# Altium schematic sheet ST_LINK_V2_1.SchDoc
size A4; SheetNumber: 1; SheetTotal: 1
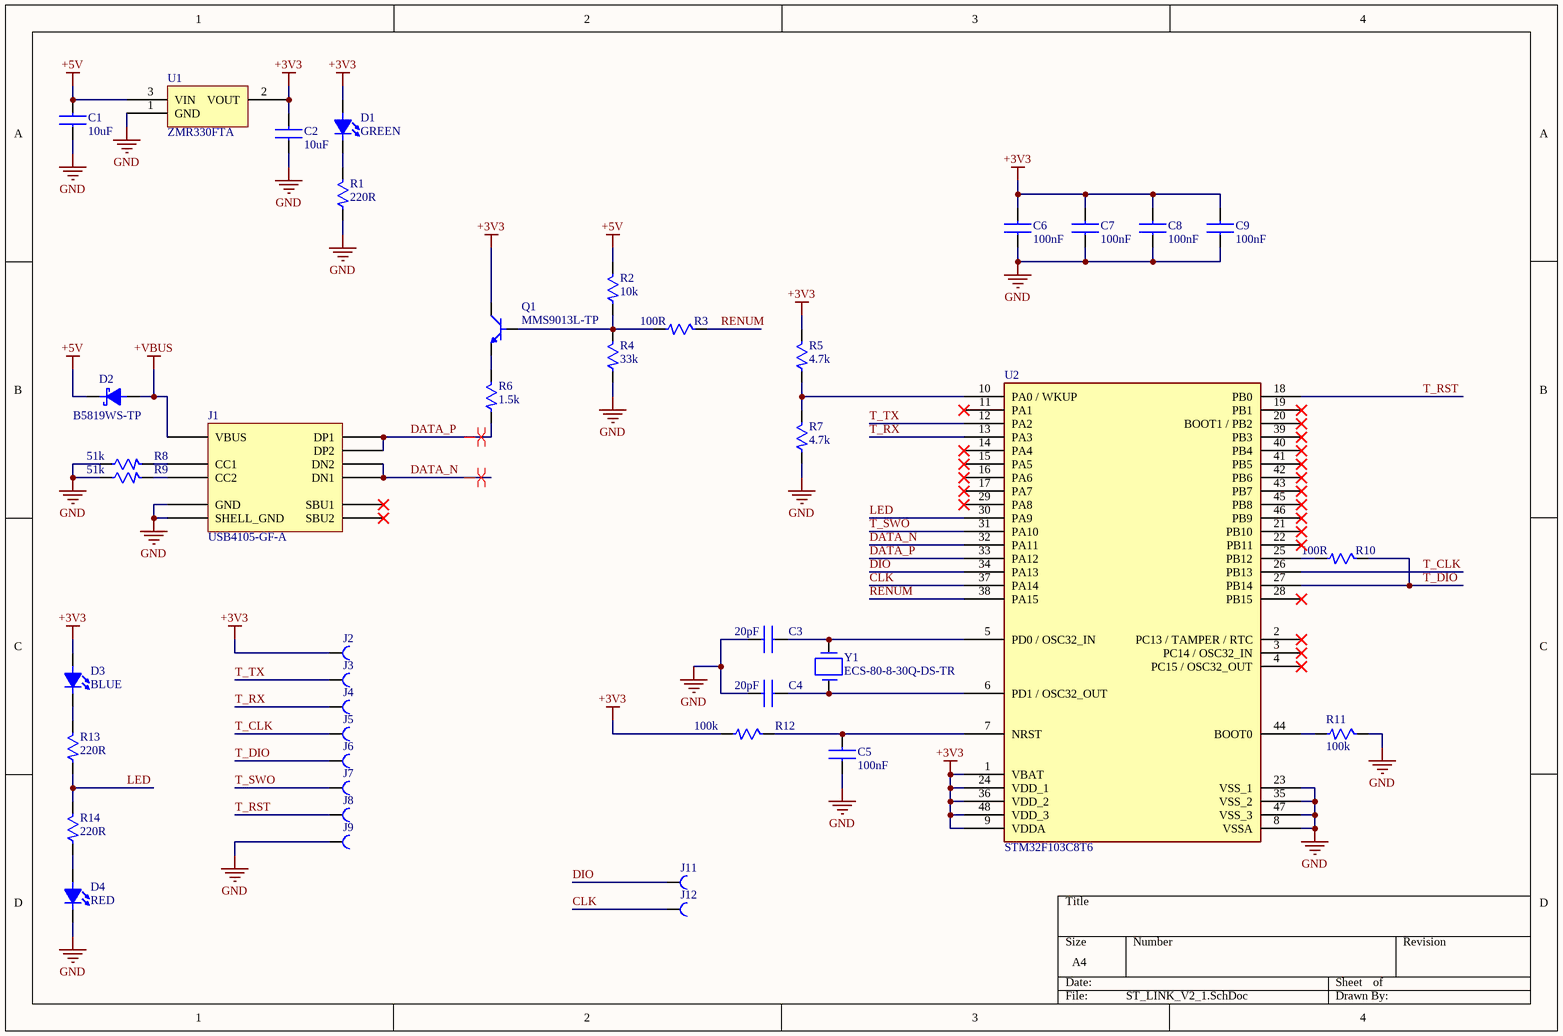
[diagram p0: ST_LINK_V2_1.SchDoc]

## Parts
C1  10uF  [C_0603]
C2  10uF  [C_0603]
C3  20pF  [C_0603]
C4  20pF  [C_0603]
C5  100nF  [C_0603]
C6  100nF  [C_0603]
C7  100nF  [C_0603]
C8  100nF  [C_0603]
C9  100nF  [C_0603]
D1  GREEN  [LED_0603_G]
D2  B5819WS-TP  [SOD_323]
D3  BLUE  [LED_0603_B]
D4  RED  [LED_0603_R]
J1  USB4105-GF-A  [USB4105-GF-A]
J2  CONST_PAD  [CONST_PAD]  (value not drawn)  (no BOM)
J3  CONST_PAD  [CONST_PAD]  (value not drawn)  (no BOM)
J4  CONST_PAD  [CONST_PAD]  (value not drawn)  (no BOM)
J5  CONST_PAD  [CONST_PAD]  (value not drawn)  (no BOM)
J6  CONST_PAD  [CONST_PAD]  (value not drawn)  (no BOM)
J7  CONST_PAD  [CONST_PAD]  (value not drawn)  (no BOM)
J8  CONST_PAD  [CONST_PAD]  (value not drawn)  (no BOM)
J9  CONST_PAD  [CONST_PAD]  (value not drawn)  (no BOM)
J11  CONST_PAD  [CONST_PAD]  (value not drawn)  (no BOM)
J12  CONST_PAD  [CONST_PAD]  (value not drawn)  (no BOM)
Q1  MMS9013L-TP  [SOT_23]
R1  220R  [R_0603]
R2  10k  [R_0603]
R3  100R  [R_0603]
R4  33k  [R_0603]
R5  4.7k  [R_0603]
R6  1.5k  [R_0603]
R7  4.7k  [R_0603]
R8  51k  [R_0603]
R9  51k  [R_0603]
R10  100R  [R_0603]
R11  100k  [R_0603]
R12  100k  [R_0603]
R13  220R  [R_0603]
R14  220R  [R_0603]
U1  ZMR330FTA  [SOT_23_REG]
U2  STM32F103C8T6  [LQFP48]
Y1  ECS-80-8-30Q-DS-TR  [ECS-80-8-30Q-DS-TR]

## Nets
+3V3: C2.2 C6.2 C7.2 C8.2 C9.2 D1.2(anode) D3.2(anode) J2.0(PAD) Q1.3 R5.2 R12.1 U1.2(VOUT) U2.1(VBAT) U2.9(VDDA) U2.24(VDD_1) U2.36(VDD_2) U2.48(VDD_3)
+5V: C1.2 D2.1(cathode) R2.2 U1.3(VIN)
+VBUS: D2.2(anode) J1.VBUS
GND: C1.1 C2.1 C3.1 C4.1 C5.1 C6.1 C7.1 C8.1 C9.1 D4.1(cathode) J1.GND J1.SHELL_GND J9.0(PAD) R1.1 R4.1 R7.1 R8.2 R9.2 R11.2 U1.1(GND) U2.8(VSSA) U2.23(VSS_1) U2.35(VSS_2) U2.47(VSS_3)
CLK: J12.0(PAD) U2.37(PA14)
DATA_N: J1.DN1 J1.DN2 U2.32(PA11)
DATA_P: J1.DP1 J1.DP2 R6.1 U2.33(PA12)
DIO: J11.0(PAD) U2.34(PA13)
LED: R13.1 R14.2 U2.30(PA9)
RENUM: R3.2 U2.38(PA15)
T_CLK: J5.0(PAD) U2.26(PB13)
T_DIO: J6.0(PAD) R10.2 U2.27(PB14)
T_RST: J8.0(PAD) U2.18(PB0)
T_RX: J4.0(PAD) U2.13(PA3)
T_SWO: J7.0(PAD) U2.31(PA10)
T_TX: J3.0(PAD) U2.12(PA2)
NetC3_2: C3.2 U2.5(PD0_/_OSC32_IN) Y1.2
NetC4_2: C4.2 U2.6(PD1_/_OSC32_OUT) Y1.1
NetC5_2: C5.2 R12.2 U2.7(NRST)
NetD1_1: D1.1(cathode) R1.2
NetD3_1: D3.1(cathode) R13.2
NetD4_2: D4.2(anode) R14.1
NetJ1_CC1: J1.CC1 R8.1
NetJ1_CC2: J1.CC2 R9.1
NetQ1_1: Q1.1 R2.1 R3.1 R4.2
NetQ1_2: Q1.2 R6.2
NetR5_1: R5.1 R7.2 U2.10(PA0_/_WKUP)
NetR10_1: R10.1 U2.25(PB12)
NetR11_1: R11.1 U2.44(BOOT0)

Not connected (* = marked no-connect by the designer): J1 SBU1* SBU2*; U2 2(PC13_/_TAMPER_/_RTC)* 3(PC14_/_OSC32_IN)* 4(PC15_/_OSC32_OUT)* 11(PA1)* 14(PA4)* 15(PA5)* 16(PA6)* 17(PA7)* 19(PB1)* 20(BOOT1_/_PB2)* 21(PB10)* 22(PB11)* 28(PB15)* 29(PA8)* 39(PB3)* 40(PB4)* 41(PB5)* 42(PB6)* 43(PB7)* 45(PB8)* 46(PB9)*

## Layout directives
differential pair: DATA_N, DATA_P

## Library data of the parts
C1 C2 = C1608X5R0J106K080AB: C Series 0603 10 uF 6.3 V ±10 % Tolerance X5R SMT Multilayer Ceramic Capacitor; Manufacturer: TDK; Voltage Rating: 6.3V; Tolerance: 10%; Supplier 1: Rs; Manufacturer Part Number: C1608X5R0J106K080AB; RoHS: Yes; Category: Ceramic Capacitors; Stock 1: 5030; Pricing 1: 50=0.01610, 100=0.14500, 250=0.12600, 500=0.10600 (GBP); Mount: Surface Mount; Case/Package: 0603; Case Code (Metric): 1608; Case Code (Imperial): 0603; Dielectric Material: Ceramic; Weight: 7.1E-05oz; Min Operating Temperature: -55°C; Max Operating Temperature: 85°C; Capacitance: 10uF; Packaging: Tape and Reel; Voltage Rating (DC): 6.3V; Dielectric: X5R; Termination: SMD/SMT; Construction: Flat; Package Quantity: 1; Resistor Type: Ceramic; Voltage: 6.3V; Series: C; Length: 1.6mm; Width: 0.031inch; Height: 0.8mm; Depth: 0.8mm; Thickness: 0.035inch; Radiation Hardening: No; Lead Free: Lead Free; Reach SVHC Compliant: Yes; RoHS Compliant: Yes; ComponentLink1URL: https://datasheet.ciiva.com/23802/1796654-23802758.pdf?src-supplier=Newark; ComponentLink1Description: https://datasheet.ciiva.com/23802/1796654-23802758.pdf?src-supplier=Newark; ComponentLink2URL: https://datasheet.ciiva.com/6288/tdkmlcccaprange-6288538.pdf?src-supplier=Digi-Key; ComponentLink2Description: https://datasheet.ciiva.com/6288/tdkmlcccaprange-6288538.pdf?src-supplier=Digi-Key; ComponentLink3URL: https://datasheet.ciiva.com/28451/1796654-28451132.pdf?src-supplier=Element14; ComponentLink3Description: https://datasheet.ciiva.com/28451/1796654-28451132.pdf?src-supplier=Element14; ComponentLink4URL: https://datasheet.ciiva.com/6288/tdkmlcccaprange-6288541.pdf?src-supplier=Digi-Key; ComponentLink4Description: https://datasheet.ciiva.com/6288/tdkmlcccaprange-6288541.pdf?src-supplier=Digi-Key; ComponentLink5URL: https://datasheet.ciiva.com/16448/general-b11-16448959.pdf?src-supplier=Future+Electronics; ComponentLink5Description: https://datasheet.ciiva.com/16448/general-b11-16448959.pdf?src-supplier=Future+Electronics; ComponentLink6URL: https://datasheet.ciiva.com/22719/1796654-22719535.pdf?src-supplier=Element14; ComponentLink6Description: https://datasheet.ciiva.com/22719/1796654-22719535.pdf?src-supplier=Element14; Supplier Part Number 1: 7882887P
C3 C4 = C0603C200K4HACAUTO: Cap Cer 0603 20PF 16V Ultra Stab; Manufacturer: KEMET; Supplier 1: Mouser; Manufacturer Part Number: C0603C200K4HACAUTO; RoHS: Yes; Category: Ceramic Capacitors; Stock 1: 12700; Pricing 1: 1=0.18000, 10=0.08500, 50=0.08500, 100=0.04000, 1000=0.02400, 10000=0.02000 (USD); RoHS Compliant: Yes; Supplier Part Number 1: 80-C0603C200K4HAUTO
C5-C9 = C0603C104M4RAC7411: Cap Ceramic 0.1uF 16V X7R 20% SMD 0603 125 Paper T/R; Manufacturer: KEMET; Dissipation Factor: 3.5%; Supplier 1: Mouser; Manufacturer Part Number: C0603C104M4RAC7411; RoHS: Yes; Category: Ceramic Capacitors; Stock 1: 1220822; Pricing 1: 1=0.10000, 10=0.02700, 50=0.02700, 100=0.01200, 1000=0.00700, 10000=0.00500 (USD); Mount: Surface Mount; Case/Package: 0603; Case Code (Imperial): 0603; Case Code (Metric): 1608; Dielectric Material: Ceramic; Min Operating Temperature: -55°C; Max Operating Temperature: 125°C; Capacitance: 100nF; Package Quantity: 10000; Voltage Rating: 16V; Tolerance: 20%; Packaging: Tape and Reel; Voltage Rating (DC): 16V; Dielectric: X7R; Termination: SMD/SMT; Series: C; Construction: Flat; Length: 1.6mm; Width: 0.8mm; Height: 0.8mm; Lead Pitch: 0.7mm; Thickness: 0.034inch; Depth: 0.8mm; Radiation Hardening: No; RoHS Compliant: Yes; ComponentLink1URL: http://components.arrow.com/part/dataview/3446650S8993799N7429?src-supplier=Arrow+Electronics; ComponentLink1Description: http://components.arrow.com/part/dataview/3446650S8993799N7429?src-supplier=Arrow+Electronics; ComponentLink2URL: http://www.mouser.com/ds/2/212/KEM_C1002_X7R_SMD-1102033.pdf?src-supplier=Mouser; ComponentLink2Description: http://www.mouser.com/ds/2/212/KEM_C1002_X7R_SMD-1102033.pdf?src-supplier=Mouser; ComponentLink3URL: http://www.farnell.com/datasheets/2747785.pdf?src-supplier=Farnell; ComponentLink3Description: http://www.farnell.com/datasheets/2747785.pdf?src-supplier=Farnell; ComponentLink4URL: http://www.jameco.com/Jameco/Products/ProdDS/1565046.pdf?src-supplier=Jameco; ComponentLink4Description: http://www.jameco.com/Jameco/Products/ProdDS/1565046.pdf?src-supplier=Jameco; ComponentLink5URL: http://www.farnell.com/datasheets/2747785.pdf?src-supplier=Element14; ComponentLink5Description: http://www.farnell.com/datasheets/2747785.pdf?src-supplier=Element14; ComponentLink6URL: http://www.farnell.com/datasheets/2747785.pdf?src-supplier=Newark; ComponentLink6Description: http://www.farnell.com/datasheets/2747785.pdf?src-supplier=Newark; ComponentLink7URL: https://api.kemet.com/component-edge/download/datasheet/C0603C104M4RAC7411.pdf?src-supplier=Digi-Key; ComponentLink7Description: https://api.kemet.com/component-edge/download/datasheet/C0603C104M4RAC7411.pdf?src-supplier=Digi-Key; ComponentLink8URL: http://www.kemet.com/docfinder?Partnumber=C0603C104M4RAC7411&src-supplier=Digi-Key; ComponentLink8Description: http://www.kemet.com/docfinder?Partnumber=C0603C104M4RAC7411&src-supplier=Digi-Key; ComponentLink9URL: http://capacitoredge.kemet.com/capedge2/DataSheet?pn=C0603C104M4RAC7411&src-supplier=Avnet; ComponentLink9Description: http://capacitoredge.kemet.com/capedge2/DataSheet?pn=C0603C104M4RAC7411&src-supplier=Avnet; ComponentLink10URL: https://www.verical.com/server-webapp/html/getDatasheet?partID=58458&src-supplier=Verical; ComponentLink10Description: https://www.verical.com/server-webapp/html/getDatasheet?partID=58458&src-supplier=Verical; Supplier Part Number 1: 80-C0603C104M4R7411
D1 = 150060GS75000: Led, Green, 520 Nm, 3.2 V, 30 Ma, 430 Mcd Rohs Compliant: Yes; Manufacturer: Wurth Electronics; Lens Color: Colorless; Wavelength: 520nm; Viewing Angle: 140°; Lens Style: Clear,Flat,Rectangular; Luminous Intensity: 430mcd; Forward Current: 30mA; Forward Voltage: 3.2V; Test Current: 20mA; Lens Transparency: Clear; Lens Size: 0.7mm; Supplier 1: Rs; Manufacturer Part Number: 150060GS75000; RoHS: Yes; Category: LEDs; Stock 1: 20200; Pricing 1: 500=0.00083, 1000=0.07900, 2000=0.07500, 4000=0.07100 (GBP); Mount: Surface Mount; Case/Package: 0603; Color: Green; Case Code (Metric): 1608; Case Code (Imperial): 0603; Min Operating Temperature: -40°C; Max Operating Temperature: 85°C; Package Quantity: 1; Packaging: Cut Tape; Dominant Wavelength: 520nm; Series: WL-SMCW; Length: 1.6mm; Width: 0.8mm; Height: 0.8mm; Lead Free: Lead Free; RoHS Compliant: Yes; ComponentLink1URL: https://datasheet.ciiva.com/29562/150060gs75000-29562868.pdf?src-supplier=Digi-Key; ComponentLink1Description: https://datasheet.ciiva.com/29562/150060gs75000-29562868.pdf?src-supplier=Digi-Key; ComponentLink2URL: https://datasheet.ciiva.com/29279/759427-da-01-en-chipled-0603-w-kl-gruen-150060gs75000-29279201.pdf?src-supplier=Conrad; ComponentLink2Description: https://datasheet.ciiva.com/29279/759427-da-01-en-chipled-0603-w-kl-gruen-150060gs75000-29279201.pdf?src-supplier=Conrad; ComponentLink3URL: https://datasheet.ciiva.com/29562/150060gs75000-29562869.pdf?src-supplier=Digi-Key; ComponentLink3Description: https://datasheet.ciiva.com/29562/150060gs75000-29562869.pdf?src-supplier=Digi-Key; ComponentLink4URL: https://datasheet.ciiva.com/29562/150060gs75000-29562870.pdf?src-supplier=Digi-Key; ComponentLink4Description: https://datasheet.ciiva.com/29562/150060gs75000-29562870.pdf?src-supplier=Digi-Key; Supplier Part Number 1: 8154209P
D2 = B5819WS-TP: DIODE SCHOTTKY 40V 1A SOD323; Manufacturer: MCC; Max Surge Current: 10A; Forward Voltage: 900mV; Max Reverse Leakage Current: 1mA; Element Configuration: Single; Supplier 1: Future Electronics; Manufacturer Part Number: B5819WS-TP; RoHS: Yes; Category: Rectifier Diodes; Stock 1: 168000; Pricing 1: 3000=0.05800, 9000=0.05580, 15000=0.05480, 45000=0.05280, 75000=0.05100 (USD); Mount: Surface Mount; Number of Pins: 2; Min Operating Temperature: -65°C; Max Operating Temperature: 125°C; Package Quantity: 1; Packaging: Tape and Reel; Average Rectified Current: 1A; Peak Non-Repetitive Surge Current: 10A; Max Reverse Voltage (DC): 40V; Series: -; Radiation Hardening: No; Lead Free: Lead Free; RoHS Compliant: Yes; ComponentLink1URL: https://datasheet.ciiva.com/4715/b5817ws-b5819wssod-323-48861-4715941.pdf?src-supplier=Mouser; ComponentLink1Description: https://datasheet.ciiva.com/4715/b5817ws-b5819wssod-323-48861-4715941.pdf?src-supplier=Mouser; ComponentLink2URL: https://datasheet.ciiva.com/15200/getdatasheetpartid-184930-15200423.pdf?src-supplier=Verical; ComponentLink2Description: https://datasheet.ciiva.com/15200/getdatasheetpartid-184930-15200423.pdf?src-supplier=Verical; ComponentLink3URL: https://datasheet.ciiva.com/912/b5817ws-b5819wssod-323-912736.pdf?src-supplier=Digi-Key; ComponentLink3Description: https://datasheet.ciiva.com/912/b5817ws-b5819wssod-323-912736.pdf?src-supplier=Digi-Key; ComponentLink4URL: https://datasheet.ciiva.com/912/b5817ws-b5819wssod-323-912737.pdf?src-supplier=Digi-Key; ComponentLink4Description: https://datasheet.ciiva.com/912/b5817ws-b5819wssod-323-912737.pdf?src-supplier=Digi-Key; ComponentLink5URL: https://datasheet.ciiva.com/912/b5817ws-b5819wssod-323-912735.pdf?src-supplier=Digi-Key; ComponentLink5Description: https://datasheet.ciiva.com/912/b5817ws-b5819wssod-323-912735.pdf?src-supplier=Digi-Key; Supplier Part Number 1: 6054560
D3 = 150060BS75003: SMT Mono-color Chip Led Watercle; Manufacturer: Wurth Electronics; Supplier 1: Rs; Manufacturer Part Number: 150060BS75003; RoHS: No; Category: LEDs; Stock 1: 11175; Pricing 1: 50=0.00824, 100=0.18100, 500=0.16500, 2000=0.13200 (GBP); Supplier Part Number 1: 2407008P
D4 = 150060RS75000: LED Low-Power Uni-Color Red 630nm 2V 2-Pin Chip 0603(1608Metric) T/R; Manufacturer: Wurth Electronics; Lens Color: Colorless; Viewing Angle: 140°; Lens Style: Clear,Flat,Rectangular; Luminous Intensity: 250mcd; Forward Current: 30mA; Wavelength: 625nm; Test Current: 20mA; Lens Transparency: Clear; Lens Size: 0.7mm; Supplier 1: Rs; Manufacturer Part Number: 150060RS75000; RoHS: Yes; Category: LEDs; Stock 1: 8900; Pricing 1: 500=0.00083, 1000=0.07900, 2000=0.07500, 4000=0.07200 (GBP); Mount: Surface Mount; Case/Package: 0603; Color: Red; Case Code (Metric): 1608; Case Code (Imperial): 0603; Min Operating Temperature: -40°C; Max Operating Temperature: 85°C; Package Quantity: 1; Packaging: Cut Tape; Forward Voltage: 2V; Dominant Wavelength: 625nm; Series: WL-SMCW; Length: 1.6mm; Width: 0.8mm; Height: 0.8mm; RoHS Compliant: Yes; ComponentLink1URL: https://datasheet.ciiva.com/29563/150060rs75000-29563040.pdf?src-supplier=Digi-Key; ComponentLink1Description: https://datasheet.ciiva.com/29563/150060rs75000-29563040.pdf?src-supplier=Digi-Key; ComponentLink2URL: https://datasheet.ciiva.com/29279/759428-da-01-en-chipled-0603-w-kl-rot-150060rs75000-29279196.pdf?src-supplier=Conrad; ComponentLink2Description: https://datasheet.ciiva.com/29279/759428-da-01-en-chipled-0603-w-kl-rot-150060rs75000-29279196.pdf?src-supplier=Conrad; Supplier Part Number 1: 8154203P
J1 = USB4105-GF-A: Conn USB 2.0 Type C RCP 24 POS 0.3mm/0.5mm Solder RA SMD 24 Terminal 1 Port T/R; Manufacturer: Global Connector Technology; Gender: Receptacle; Mating Cycles: 10000; Shielding: Shielded; Number of Ports: 1; Supplier 1: Future Electronics; Manufacturer Part Number: USB4105-GF-A; RoHS: No; Category: USB Connectors; Stock 1: 800; Pricing 1: 800=0.45000, 1600=0.44000, 2400=0.43500, 3200=0.43000, 4000=0.42000 (USD); Mount: Surface Mount,Through Hole,Horizontal; Contact Plating: Gold; Insulation Color: Black; Min Operating Temperature: -40°C; Max Operating Temperature: 85°C; Connector Type: USB; Series: USB4105; Termination: Solder; Flammability Rating: UL94 V-0; ComponentLink1URL: https://gct.co/files/drawings/usb4105.pdf?src-supplier=Digi-Key; ComponentLink1Description: https://gct.co/files/drawings/usb4105.pdf?src-supplier=Digi-Key; Supplier Part Number 1: 3158113
Q1 = MMS9013L-TP: Trans Gp Bjt NPN 25V 0.5A 3-PIN SOT-23 T/r; Manufacturer: MCC; Number of Elements: 1; Collector Base Voltage (VCBO): 40V; Emitter Base Voltage (VEBO): 5V; Power Dissipation: 300mW; Frequency: 150MHz; Supplier 1: Mouser; Manufacturer Part Number: MMS9013L-TP; RoHS: Yes; Category: BJTs; Stock 1: 2960; Pricing 1: 1=0.28000, 10=0.22800, 50=0.22800, 100=0.12100, 1000=0.05500, 10000=0.03600 (USD); Mount: Surface Mount; Case/Package: SOT-23; Number of Pins: 3; Min Operating Temperature: -55°C; Max Operating Temperature: 150°C; Polarity: NPN; Packaging: Tape and Reel; Collector Emitter Voltage (VCEO): 25V; ComponentLink1URL: http://components.arrow.com/part/dataview/51062823S110403N2022?src-supplier=Arrow+Electronics; ComponentLink1Description: http://components.arrow.com/part/dataview/51062823S110403N2022?src-supplier=Arrow+Electronics; Supplier Part Number 1: 833-MMS9013L-TP
R1 R13 R14 = RC0603FR-07220RL: Res Thick Film 0603 220 Ohm 1% 0.1W(1/10W) ±100ppm/°C Pad SMD T/R; Manufacturer: Yageo; Voltage Rating (DC): 50V; Power Rating: 100mW; Supplier 1: Future Electronics; Manufacturer Part Number: RC0603FR-07220RL; RoHS: Yes; Category: Chip SMD Resistors; Stock 1: 2420000; Pricing 1: 5000=0.00140, 50000=0.00130, 200000=0.00130, 625000=0.00120, 2000000=0.00110 (USD); Case/Package: 0603; Number of Pins: 2; Case Code (Imperial): 0603; Case Code (Metric): 1608; Size Code: 0603; Min Operating Temperature: -55°C; Max Operating Temperature: 155°C; Resistance: 220R; Tolerance: 1%; Packaging: Tape and Reel; Temperature Coefficient: 100ppm/°C; Resistor Type: Thick Film; Voltage Rating: 50V; Package Quantity: 1; Termination: SMD/SMT; Number of Terminations: 2; Max Power Dissipation: 100mW; Features: Moisture Resistant; Series: RC; Resistance Tolerance: 1%; Construction: Rectangular; Length: 0.063inch; Width: 0.031inch; Height: 0.022inch; Depth: 0.8mm; Reach SVHC Compliant: Yes; Lead Free: Lead Free; Military Standard: Not; RoHS Compliant: Yes; ComponentLink1URL: https://datasheet.ciiva.com/2453/pyu-r-int-thick-7-2453974.pdf?src-supplier=Digi-Key; ComponentLink1Description: https://datasheet.ciiva.com/2453/pyu-r-int-thick-7-2453974.pdf?src-supplier=Digi-Key; ComponentLink2URL: https://datasheet.ciiva.com/2453/pyu-r-int-thick-7-2453975.pdf?src-supplier=Digi-Key; ComponentLink2Description: https://datasheet.ciiva.com/2453/pyu-r-int-thick-7-2453975.pdf?src-supplier=Digi-Key; ComponentLink3URL: https://datasheet.ciiva.com/2453/pyu-r-int-thick-7-2453973.pdf?src-supplier=Digi-Key; ComponentLink3Description: https://datasheet.ciiva.com/2453/pyu-r-int-thick-7-2453973.pdf?src-supplier=Digi-Key; ComponentLink4URL: https://datasheet.ciiva.com/7746/1738695-7746301.pdf?src-supplier=Element14; ComponentLink4Description: https://datasheet.ciiva.com/7746/1738695-7746301.pdf?src-supplier=Element14; ComponentLink5URL: https://datasheet.ciiva.com/7746/1738695-7746300.pdf?src-supplier=Element14; ComponentLink5Description: https://datasheet.ciiva.com/7746/1738695-7746300.pdf?src-supplier=Element14; Supplier Part Number 1: 9705021
R2 = RC0603FR-0710KL: RES SMD 10K OHM 1% 1/10W 0603; Manufacturer: Yageo; Voltage Rating (DC): 50V; Resistance: 10kR; Temperature Coefficient: 100ppm/°C; Power Rating: 100mW; Voltage Rating: 75V; Supplier 1: Future Electronics; Manufacturer Part Number: RC0603FR-0710KL; RoHS: Yes; Category: Chip SMD Resistors; Stock 1: 252929; Pricing 1: 1=0.10000, 20=0.06640, 100=0.04840, 500=0.03040, 2500=0.01240 (USD); Case/Package: 0603; Number of Pins: 2; Case Code (Imperial): 0603; Case Code (Metric): 1608; Weight: 7.1E-05oz; Size Code: 0603; Min Operating Temperature: -55°C; Max Operating Temperature: 155°C; Packaging: Tape and Reel; Tolerance: 1%; Resistor Type: Thick Film; Termination: SMD/SMT; Features: Moisture Resistant; Series: RC; Max Power Dissipation: 100mW; Number of Terminations: 2; Resistance Tolerance: 1%; Construction: Rectangular; Length: 1.6mm; Width: 0.8mm; Height: 0.45mm; Depth: 0.8mm; Lead Pitch: 0.3mm; Reach SVHC Compliant: Yes; Lead Free: Lead Free; Military Standard: Not; RoHS Compliant: Yes; ComponentLink1URL: https://datasheet.ciiva.com/7660/38590-7660789.pdf?src-supplier=Element14; ComponentLink1Description: https://datasheet.ciiva.com/7660/38590-7660789.pdf?src-supplier=Element14; ComponentLink2URL: https://datasheet.ciiva.com/7983/443971-7983596.pdf?src-supplier=Element14; ComponentLink2Description: https://datasheet.ciiva.com/7983/443971-7983596.pdf?src-supplier=Element14; ComponentLink3URL: https://datasheet.ciiva.com/22747/443971-22747519.pdf?src-supplier=Element14; ComponentLink3Description: https://datasheet.ciiva.com/22747/443971-22747519.pdf?src-supplier=Element14; ComponentLink4URL: https://datasheet.ciiva.com/46440/1868787-46440891.pdf?src-supplier=Element14; ComponentLink4Description: https://datasheet.ciiva.com/46440/1868787-46440891.pdf?src-supplier=Element14; ComponentLink5URL: https://datasheet.ciiva.com/7746/1738695-7746239.pdf?src-supplier=Element14; ComponentLink5Description: https://datasheet.ciiva.com/7746/1738695-7746239.pdf?src-supplier=Element14; Supplier Part Number 1: 3349388
R3 R10 = AR0603FR-07100RL: Res Thick Film 0603 100 Ohm 1% 1/10W ±100ppm/°C Molded SMD SMD Paper T/R; Manufacturer: Yageo; Max Power Dissipation: 100mW; Supplier 1: Mouser; Manufacturer Part Number: AR0603FR-07100RL; RoHS: Yes; Category: Chip SMD Resistors; Stock 1: 2721; Pricing 1: 1=0.44000, 10=0.33800, 50=0.33800, 100=0.14200, 1000=0.07900, 10000=0.06400 (USD); Case/Package: 0603; Contact Plating: Gold; Min Operating Temperature: -55°C; Max Operating Temperature: 155°C; Resistance: 100R; Tolerance: 1%; Packaging: Tape and Reel; Resistor Type: Thick Film; Number of Terminations: 2; Temperature Coefficient: 100ppm/°C; Features: Moisture Resistant; Series: AR; Length: 0.063inch; Width: 0.032inch; Height: 0.022inch; Radiation Hardening: No; RoHS Compliant: Yes; ComponentLink1URL: https://datasheet.ciiva.com/8887/pyu-ar-51-rohs-l-7-8887862.pdf?src-supplier=Avnet; ComponentLink1Description: https://datasheet.ciiva.com/8887/pyu-ar-51-rohs-l-7-8887862.pdf?src-supplier=Avnet; Supplier Part Number 1: 603-AR0603FR-07100RL
R4 = RC0603FR-0733KL: Res Thick Film 0603 33K Ohm 1% 0.1W(1/10W) ±100ppm/C Pad SMD T/R; Manufacturer: Yageo; Resistance: 33kR; Voltage Rating (DC): 50V; Temperature Coefficient: 100ppm/°C; Power Rating: 100mW; Supplier 1: Future Electronics; Manufacturer Part Number: RC0603FR-0733KL; RoHS: Yes; Category: Chip SMD Resistors; Stock 1: 3300000; Pricing 1: 5000=0.00140, 50000=0.00130, 200000=0.00130, 625000=0.00120, 2000000=0.00110 (USD); Case/Package: 0603; Number of Pins: 2; Case Code (Imperial): 0603; Case Code (Metric): 1608; Size Code: 0603; Min Operating Temperature: -55°C; Max Operating Temperature: 155°C; Tolerance: 1%; Packaging: Tape and Reel; Resistor Type: Thick Film; Voltage Rating: 50V; Package Quantity: 1; Termination: SMD/SMT; Number of Terminations: 2; Max Power Dissipation: 100mW; Features: Moisture Resistant; Series: RC; Resistance Tolerance: 1%; Construction: Rectangular; Length: 0.063inch; Width: 0.031inch; Height: 0.022inch; Depth: 0.8mm; Reach SVHC Compliant: Yes; Lead Free: Lead Free; Military Standard: Not; RoHS Compliant: Yes; ComponentLink1URL: https://datasheet.ciiva.com/46395/443971-46395005.pdf?src-supplier=Element14; ComponentLink1Description: https://datasheet.ciiva.com/46395/443971-46395005.pdf?src-supplier=Element14; ComponentLink2URL: https://datasheet.ciiva.com/2454/pyu-r-int-thick-7-2454010.pdf?src-supplier=Digi-Key; ComponentLink2Description: https://datasheet.ciiva.com/2454/pyu-r-int-thick-7-2454010.pdf?src-supplier=Digi-Key; ComponentLink3URL: https://datasheet.ciiva.com/2454/pyu-r-int-thick-7-2454011.pdf?src-supplier=Digi-Key; ComponentLink3Description: https://datasheet.ciiva.com/2454/pyu-r-int-thick-7-2454011.pdf?src-supplier=Digi-Key; ComponentLink4URL: https://datasheet.ciiva.com/2454/pyu-r-int-thick-7-2454009.pdf?src-supplier=Digi-Key; ComponentLink4Description: https://datasheet.ciiva.com/2454/pyu-r-int-thick-7-2454009.pdf?src-supplier=Digi-Key; ComponentLink5URL: https://datasheet.ciiva.com/7746/443971-7746332.pdf?src-supplier=Element14; ComponentLink5Description: https://datasheet.ciiva.com/7746/443971-7746332.pdf?src-supplier=Element14; ComponentLink6URL: https://datasheet.ciiva.com/7746/443971-7746333.pdf?src-supplier=Element14; ComponentLink6Description: https://datasheet.ciiva.com/7746/443971-7746333.pdf?src-supplier=Element14; ComponentLink7URL: https://datasheet.ciiva.com/15189/getdatasheetpartid-353493-15189706.pdf?src-supplier=Verical; ComponentLink7Description: https://datasheet.ciiva.com/15189/getdatasheetpartid-353493-15189706.pdf?src-supplier=Verical; Supplier Part Number 1: 9831728
R5 R7 = 1622960-1: Res Thick Film 0603 4.7K Ohm 1% 0.1W(1/10W) ±100ppm/C Pad SMD T/R; Manufacturer: TE Connectivity; Supplier 1: Newark; Manufacturer Part Number: 1622960-1; RoHS: Yes; Category: Uncategorized; Stock 1: 19907; Pricing 1: 1=0.004000, 25=0.004000, 100=0.004000, 250=0.004000, 500=0.004000, 1000=0.004000 (USD); ComponentLink1URL: https://datasheet.ciiva.com/6538/eng-cd-1622282-ba-6538072.pdf?src-supplier=Digi-Key; ComponentLink1Description: https://datasheet.ciiva.com/6538/eng-cd-1622282-ba-6538072.pdf?src-supplier=Digi-Key; ComponentLink2URL: https://datasheet.ciiva.com/8912/eng-ds-1773204-f-8912646.pdf?src-supplier=Avnet; ComponentLink2Description: https://datasheet.ciiva.com/8912/eng-ds-1773204-f-8912646.pdf?src-supplier=Avnet; Supplier Part Number 1: 46AK9345
R6 = RC0603FR-071K5L: Res General Purpose Thick Film 0603 1.5K Ohm 1% 1/10W ±100ppm/°C Molded SMD Paper T/R; Manufacturer: Yageo; Voltage Rating (DC): 50V; Resistance: 1.5kR; Power Rating: 100mW; Supplier 1: Future Electronics; Manufacturer Part Number: RC0603FR-071K5L; RoHS: Yes; Category: Chip SMD Resistors; Stock 1: 16310000; Pricing 1: 5000=0.00150, 50000=0.00140, 100000=0.00140, 200000=0.00140, 375000=0.00140, 625000=0.00130, 1250000=0.00130, 2000000=0.00120, 5000000=0.00120 (USD); Case/Package: 0603; Number of Pins: 2; Case Code (Metric): 1608; Case Code (Imperial): 0603; Size Code: 0603; Min Operating Temperature: -55°C; Max Operating Temperature: 155°C; Tolerance: 1%; Packaging: Tape and Reel; Temperature Coefficient: 100ppm/°C; Resistor Type: Thick Film; Voltage Rating: 50V; Package Quantity: 1; Number of Terminations: 2; Termination: SMD/SMT; Max Power Dissipation: 100mW; Features: Moisture Resistant; Series: RC; Resistance Tolerance: 1%; Construction: Rectangular; Length: 0.063inch; Width: 0.031inch; Height: 0.022inch; Depth: 0.8mm; Reach SVHC Compliant: Yes; Lead Free: Lead Free; Military Standard: Not; RoHS Compliant: Yes; Supplier Part Number 1: 5194295
R8 R9 = AF0603FR-0751KL: Res Thick Film 0603 51K Ohm 1% 1/10W ±100ppm/°C Molded SMD Paper T/R; Manufacturer: Yageo; Resistance: 51kR; Max Power Dissipation: 100mW; Supplier 1: Mouser; Manufacturer Part Number: AF0603FR-0751KL; RoHS: Yes; Category: Chip SMD Resistors; Stock 1: 893; Pricing 1: 1=0.19000, 10=0.06300, 50=0.06300, 100=0.02600, 1000=0.01200, 10000=0.00800 (USD); Case/Package: 0603; Min Operating Temperature: -55°C; Max Operating Temperature: 155°C; Packaging: Tape and Reel; Resistor Type: Thick Film; Number of Terminations: 2; Tolerance: 1%; Temperature Coefficient: 100ppm/°C; Features: Moisture Resistant,Anti-Sulfur; Length: 0.063inch; Width: 0.031inch; Height: 0.022inch; RoHS Compliant: Yes; ComponentLink1URL: http://www.yageo.com/documents/recent/PYu-AF_51_RoHS_L_5.pdf?src-supplier=Digi-Key; ComponentLink1Description: http://www.yageo.com/documents/recent/PYu-AF_51_RoHS_L_5.pdf?src-supplier=Digi-Key; Supplier Part Number 1: 603-AF0603FR-0751KL
R11 R12 = RC0603FR-07100KL: RES SMD 100K OHM 1% 1/10W 0603; Manufacturer: Yageo; Resistance: 100kR; Voltage Rating (DC): 50V; Temperature Coefficient: 100ppm/°C; Power Rating: 100mW; Working Voltage: 75V; Supplier 1: Future Electronics; Manufacturer Part Number: RC0603FR-07100KL; RoHS: Yes; Category: Chip SMD Resistors; Stock 1: 32435000; Pricing 1: 5000=0.00140, 50000=0.00130, 200000=0.00130, 625000=0.00120, 2000000=0.00110 (USD); Case/Package: 0603; Number of Pins: 2; Case Code (Imperial): 0603; Case Code (Metric): 1608; Min Operating Temperature: -55°C; Max Operating Temperature: 155°C; Tolerance: 1%; Packaging: Tape and Reel; Resistor Type: Thick Film; Voltage Rating: 50V; Termination: SMD/SMT; Number of Terminations: 2; Features: Moisture Resistant; Series: RC; Max Power Dissipation: 100mW; Resistance Tolerance: 1%; Construction: Rectangular; Technology: THICK FILM; Length: 1.6mm; Width: 0.8mm; Height: 0.45mm; Depth: 0.8mm; Reach SVHC Compliant: Yes; Lead Free: Lead Free; Military Standard: Not; RoHS Compliant: Yes; Supplier Part Number 1: 3697448
U1 = ZMR330FTA: ZMR330 Series 3.3 V 50 mA Fixed Output SMT Miniature Voltage Regulator - SOT-23; Manufacturer: Diodes Zetex; Power Rating: 500mW; Max Input Voltage: 24V; Min Input Voltage: 4.8V; Number of Outputs: 1; Max Output Current: 50mA; Output Voltage: 3.3V; Polarity: Positive; Power Supply Rejection Ratio (PSRR): 55dB; Supplier 1: Rs; Manufacturer Part Number: ZMR330FTA; RoHS: Yes; Category: Voltage Regulators - Linear; Stock 1: 4550; Pricing 1: 30=0.15480, 150=0.66200, 750=0.55400, 1500=0.43800 (GBP); Mount: Surface Mount; Case/Package: SOT-23; Number of Pins: 3; Weight: 0.000282oz; Min Operating Temperature: -55°C; Max Operating Temperature: 125°C; Max Power Dissipation: 500mW; Package Quantity: 3000; Packaging: Tape and Reel; Output Current: 50mA; Number of Regulators: 1; Power Dissipation: 500mW; Min Output Voltage: 3.3V; Output Type: Fixed; Series: -; Length: 3.04mm; Width: 1.4mm; Height: 1.02mm; Radiation Hardening: No; Reach SVHC Compliant: Yes; Lead Free: Lead Free; RoHS Compliant: Yes; ComponentLink1URL: https://datasheet.ciiva.com/2040/zmrseries-2040368.pdf?src-supplier=Digi-Key; ComponentLink1Description: https://datasheet.ciiva.com/2040/zmrseries-2040368.pdf?src-supplier=Digi-Key; ComponentLink2URL: https://datasheet.ciiva.com/8240/zmrseries-8240837.pdf?src-supplier=Avnet; ComponentLink2Description: https://datasheet.ciiva.com/8240/zmrseries-8240837.pdf?src-supplier=Avnet; ComponentLink3URL: https://datasheet.ciiva.com/16509/zmrseries-16509194.pdf?src-supplier=Future+Electronics; ComponentLink3Description: https://datasheet.ciiva.com/16509/zmrseries-16509194.pdf?src-supplier=Future+Electronics; Supplier Part Number 1: 7106313P
U2 = STM32F103C8T6: IC MCU 32BIT 64KB FLASH 48LQFP; Manufacturer: STMicroelectronics; RAM Size: 20KB; Frequency: 72MHz; Max Power Dissipation: 363mW; Interface: I2C,SPI,USB,CAN,USART; Number of I/Os: 37; Number of Timers/Counters: 3; Max Supply Voltage: 3.6V; Number of ADC Channels: 10; Min Supply Voltage: 2V; Oscillator Type: Internal; Number of Programmable I/O: 48; Data Bus Width: 32b; Number of Bits: 32; Watchdog Timer: Yes; Peripherals: POR,PWM,WDT,DMA,Temp Sensor,I2C; Core Architecture: ARM; Number of PWM Channels: 1; Number of SPI Channels: 2; Supplier 1: Mouser; Manufacturer Part Number: STM32F103C8T6; RoHS: Yes; Category: Microcontrollers; Stock 1: 33571; Pricing 1: 1=6.66000, 10=6.02000, 50=4.98000, 100=4.98000, 1000=3.75000, 10000=3.67000 (USD); Case/Package: LQFP; Number of Pins: 48; Weight: 0.006349oz; Min Operating Temperature: -40°C; Max Operating Temperature: 85°C; Packaging: Tray; Package Quantity: 1500; Density: 64KB; Memory Type: FLASH; Max Frequency: 72MHz; Memory Size: 64KB; Series: STM32F103C8; Termination: SMD/SMT; Number of I2C Channels: 2; Address Bus Width: 32b; Length: 7mm; Width: 7mm; Height: 1.4mm; Radiation Hardening: No; Lead Free: Lead Free; Reach SVHC Compliant: Yes; RoHS Compliant: Yes; ComponentLink1URL: https://datasheet.ciiva.com/15122/getdatasheetpartid-69880-15122076.pdf?src-supplier=Verical; ComponentLink1Description: https://datasheet.ciiva.com/15122/getdatasheetpartid-69880-15122076.pdf?src-supplier=Verical; ComponentLink2URL: https://datasheet.ciiva.com/8054/1730126-8054942.pdf?src-supplier=Element14; ComponentLink2Description: https://datasheet.ciiva.com/8054/1730126-8054942.pdf?src-supplier=Element14; ComponentLink3URL: https://datasheet.ciiva.com/14100/pustm-arm-microcont-stm32f103-en-14100508.pdf?src-supplier=Distrelec; ComponentLink3Description: https://datasheet.ciiva.com/14100/pustm-arm-microcont-stm32f103-en-14100508.pdf?src-supplier=Distrelec; ComponentLink4URL: https://datasheet.ciiva.com/16210/cd00161566-16210248.pdf?src-supplier=Future+Electronics; ComponentLink4Description: https://datasheet.ciiva.com/16210/cd00161566-16210248.pdf?src-supplier=Future+Electronics; ComponentLink5URL: https://datasheet.ciiva.com/48687/001075658-da-01-en-mcu-64kb-mem-stm32f103c8t6-lqfp-48-stm-48687589.pdf?src-supplier=Conrad; ComponentLink5Description: https://datasheet.ciiva.com/48687/001075658-da-01-en-mcu-64kb-mem-stm32f103c8t6-lqfp-48-stm-48687589.pdf?src-supplier=Conrad; Supplier Part Number 1: 511-STM32F103C8T6
Y1 = ECS-80-8-30Q-DS-TR: Crystal 8.000 Mhz 8PF SMD; Manufacturer: ECS International; Supplier 1: Mouser; Manufacturer Part Number: ECS-80-8-30Q-DS-TR; RoHS: Yes; Category: Uncategorized; Stock 1: 2000; Pricing 1: 1=0.84000, 10=0.73600, 50=0.73600, 100=0.60800, 1000=0.47900, 10000=0.43100 (USD); RoHS Compliant: Yes; Supplier Part Number 1: 520-80-8-30Q-DS-TR